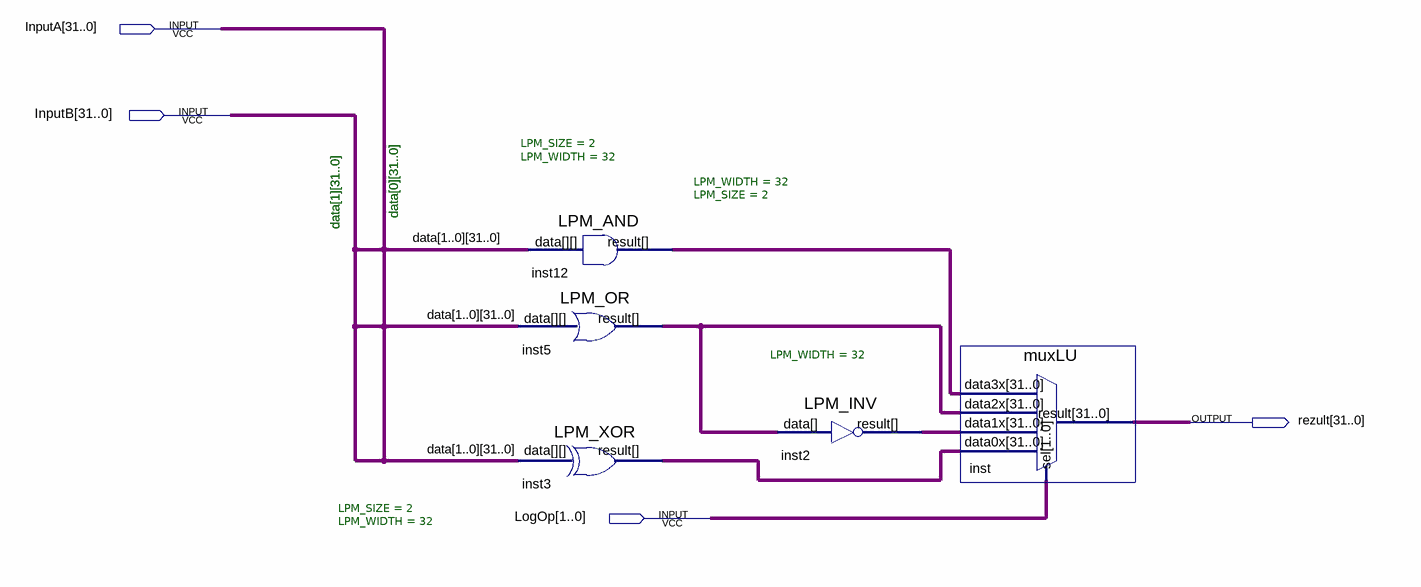
[diagram p0: schematic sheet]
// Quartus schematic LogicUnit.bdf as structural Verilog: 5 symbols, 4 pins
module LogicUnit (
  input  [31:0] InputA,
  input  [31:0] InputB,
  input  [1:0] LogOp,
  output [31:0] rezult
);

  wire [31:0] inst2_result, inst3_result, inst5_result, inst12_result;

  LPM_AND #(.LPM_SIZE(2), .LPM_WIDTH(32)) inst12 (.data({InputB, InputA}), .result(inst12_result));
  LPM_OR #(.LPM_WIDTH(32), .LPM_SIZE(2)) inst5 (.data({InputB, InputA}), .result(inst5_result));
  LPM_XOR #(.LPM_SIZE(2), .LPM_WIDTH(32)) inst3 (.data({InputB, InputA}), .result(inst3_result));
  LPM_INV #(.LPM_WIDTH(32)) inst2 (.data(inst5_result), .result(inst2_result));
  muxLU inst (
    .data3x(inst12_result), .data2x(inst5_result), .data1x(inst2_result), .data0x(inst3_result), .sel(LogOp),
    .result(rezult));

  // Other names for the same wires on the sheet: data_1[31:0] = InputB; data_0[31:0] = InputA

  // Notes on the sheet:
  //   data[0][31..0]
  //   data[1][31..0]
endmodule
